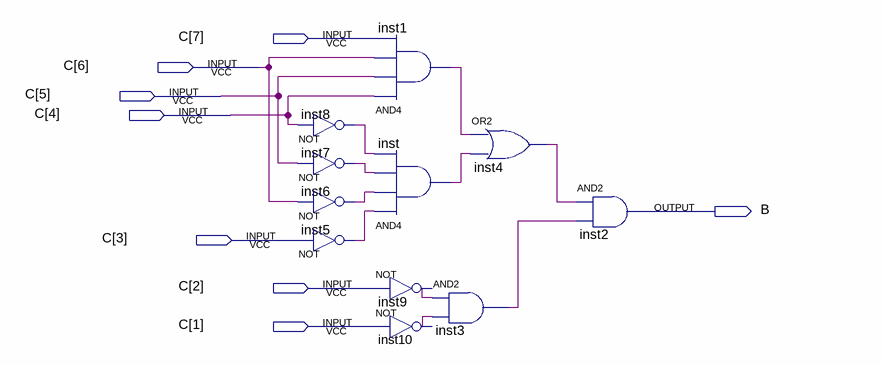
[diagram p0: schematic sheet]
// Quartus schematic cdp_b.bdf as structural Verilog: 11 symbols, 8 pins
module cdp_b (
  input  [7:1] C,
  output B
);

  wire inst1_out, inst3_out, inst4_out, inst5_out, inst6_out, inst7_out, inst8_out, inst9_out, inst10_out,
       inst_out;

  not inst8 (inst8_out, C[4]);
  not inst7 (inst7_out, C[5]);
  not inst6 (inst6_out, C[6]);
  not inst5 (inst5_out, C[3]);
  and inst1 (inst1_out, C[4], C[5], C[6], C[7]);
  and inst (inst_out, inst5_out, inst6_out, inst7_out, inst8_out);
  not inst9 (inst9_out, C[2]);
  not inst10 (inst10_out, C[1]);
  or inst4 (inst4_out, inst1_out, inst_out);
  and inst3 (inst3_out, inst9_out, inst10_out);
  and inst2 (B, inst4_out, inst3_out);
endmodule
